# EAGLE design wavefreak (EAGLE 7.4.0)

## Sheet 1 of 3
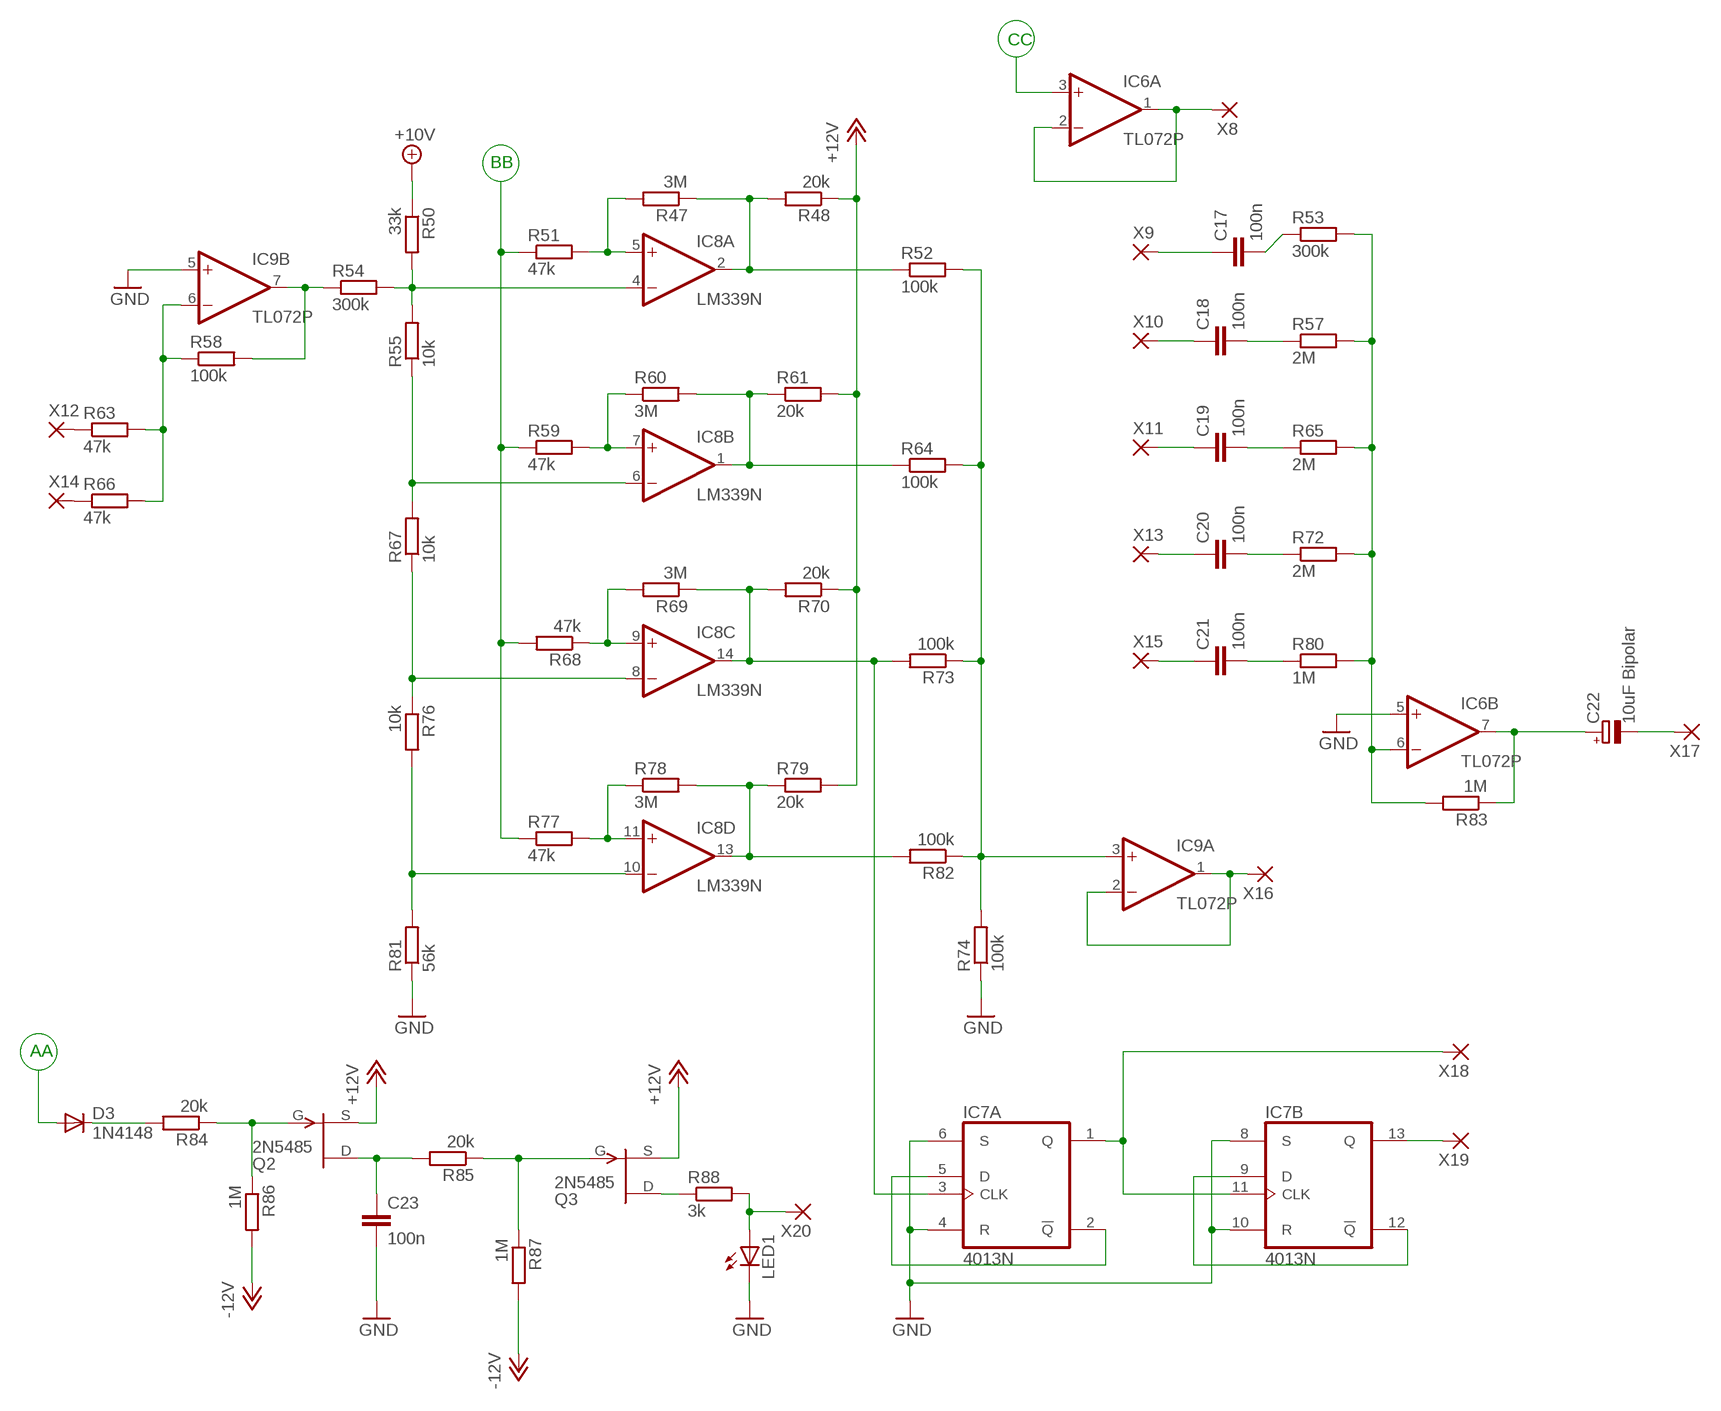
[diagram p0: schematic, sheet 1]

### Parts
C17  100n  C-EU050-025X075  [C050-025X075]
C18  100n  C-EU050-025X075  [C050-025X075]
C19  100n  C-EU050-025X075  [C050-025X075]
C20  100n  C-EU050-025X075  [C050-025X075]
C21  100n  C-EU050-025X075  [C050-025X075]
C22  10uF Bipolar  CPOL-EUE3.5-8  [E3,5-8]
C23  100n  C-EU050-025X075  [C050-025X075]
D3  1N4148  1N4148DO35-7  [DO35-7]
IC6  TL072P  [DIL08]
IC7  4013N  [DIL14]
IC8  LM339N  [DIL14]
IC9  TL072P  [DIL08]
LED1  LED3MM  [LED3MM]
Q2  2N5485  [TO92-]
Q3  2N5485  [TO92-]
R47  3M  R-EU_0309/10  [0309/10]
R48  20k  R-EU_0309/10  [0309/10]
R50  33k  R-EU_0309/10  [0309/10]
R51  47k  R-EU_0309/10  [0309/10]
R52  100k  R-EU_0309/10  [0309/10]
R53  300k  R-EU_0309/V  [0309V]
R54  300k  R-EU_0309/V  [0309V]
R55  10k  R-EU_0309/10  [0309/10]
R57  2M  R-EU_0309/V  [0309V]
R58  100k  R-EU_0309/V  [0309V]
R59  47k  R-EU_0309/10  [0309/10]
R60  3M  R-EU_0309/10  [0309/10]
R61  20k  R-EU_0309/10  [0309/10]
R63  47k  R-EU_0309/V  [0309V]
R64  100k  R-EU_0309/10  [0309/10]
R65  2M  R-EU_0309/V  [0309V]
R66  47k  R-EU_0309/V  [0309V]
R67  10k  R-EU_0309/10  [0309/10]
R68  47k  R-EU_0309/10  [0309/10]
R69  3M  R-EU_0309/10  [0309/10]
R70  20k  R-EU_0309/10  [0309/10]
R72  2M  R-EU_0309/V  [0309V]
R73  100k  R-EU_0309/10  [0309/10]
R74  100k  R-EU_0309/10  [0309/10]
R76  10k  R-EU_0309/10  [0309/10]
R77  47k  R-EU_0309/10  [0309/10]
R78  3M  R-EU_0309/10  [0309/10]
R79  20k  R-EU_0309/10  [0309/10]
R80  1M  R-EU_0309/V  [0309V]
R81  56k  R-EU_0309/10  [0309/10]
R82  100k  R-EU_0309/10  [0309/10]
R83  1M  R-EU_0309/V  [0309V]
R84  20k  R-EU_0309/V  [0309V]
R85  20k  R-EU_0309/V  [0309V]
R86  1M  R-EU_0309/V  [0309V]
R87  1M  R-EU_0309/V  [0309V]
R88  3k  R-EU_0309/V  [0309V]
X8  2,54/1,0  [2,54/1,0]
X9  2,54/1,0  [2,54/1,0]
X10  2,54/1,0  [2,54/1,0]
X11  2,54/1,0  [2,54/1,0]
X12  2,54/1,0  [2,54/1,0]
X13  2,54/1,0  [2,54/1,0]
X14  2,54/1,0  [2,54/1,0]
X15  2,54/1,0  [2,54/1,0]
X16  2,54/1,0  [2,54/1,0]
X17  2,54/1,0  [2,54/1,0]
X18  2,54/1,0  [2,54/1,0]
X19  2,54/1,0  [2,54/1,0]
X20  2,54/1,0  [2,54/1,0]

### Nets
+10V: R50.1 ; also sheet 2
+12V: Q2.2(S) Q3.2(S) R48.1 R61.2 R70.1 R79.2 ; also sheet 2,3
-12V: R86.2 R87.2 ; also sheet 2,3
AA: D3.A ; also sheet 2
BB: R51.1 R59.1 R68.2 R77.1 ; also sheet 2
CC: IC6.3(A:+IN) ; also sheet 2
GND: C23.2 IC6.5(B:+IN) IC7.4(A:R) IC7.6(A:S) IC7.8(B:S) IC7.10(B:R) IC9.5(B:+IN) LED1.K(C) R74.1 R81.1 ; also sheet 2,3
N$39: C18.1 X10.1(P)
N$43: C17.2 R53.1
N$44: C18.2 R57.1
N$45: C19.2 R65.1
N$46: C20.2 R72.1
N$47: C21.2 R80.1
N$48: C22.+ IC6.7(B:OUT) R83.1
N$49: LED1.A R88.2 X20.1(P)
N$50: Q3.3(D) R88.1
N$51: IC6.6(B:-IN) R53.2 R57.2 R65.2 R72.2 R80.2 R83.2
N$52: C19.1 X11.1(P)
N$53: C20.1 X13.1(P)
N$54: C21.1 X15.1(P)
N$55: IC9.1(A:OUT) IC9.2(A:-IN) X16.1(P)
N$56: IC9.6(B:-IN) R58.1 R63.2 R66.2
N$57: R63.1 X12.1(P)
N$58: R66.1 X14.1(P)
N$59: IC9.7(B:OUT) R54.1 R58.2
N$60: IC8.4(A:-IN) R50.2 R54.2 R55.2
N$61: IC8.6(B:-IN) R55.1 R67.2
N$62: IC8.8(C:-IN) R67.1 R76.1
N$63: IC8.10(D:-IN) R76.2 R81.2
N$64: IC8.11(D:+IN) R77.2 R78.1
N$65: IC8.9(C:+IN) R68.1 R69.2
N$66: IC8.7(B:+IN) R59.2 R60.1
N$67: IC8.5(A:+IN) R47.2 R51.2
N$68: IC8.2(A:OUT) R47.1 R48.2 R52.1
N$69: IC8.1(B:OUT) R60.2 R61.1 R64.1
N$70: IC7.3(A:CLK) IC8.14(C:OUT) R69.1 R70.2 R73.2
N$71: IC8.13(D:OUT) R78.2 R79.1 R82.2
N$72: IC9.3(A:+IN) R52.2 R64.2 R73.1 R74.2 R82.1
N$73: C17.1 X9.1(P)
N$74: Q3.1(G) R85.1 R87.1
N$75: C23.1 Q2.3(D) R85.2
N$76: IC7.2(A:!Q) IC7.5(A:D)
N$77: IC7.1(A:Q) IC7.11(B:CLK) X18.1(P)
N$78: IC7.9(B:D) IC7.12(B:!Q)
N$79: IC7.13(B:Q) X19.1(P)
N$80: C22.- X17.1(P)
N$81: Q2.1(G) R84.1 R86.1
N$82: D3.C R84.2
N$83: IC6.1(A:OUT) IC6.2(A:-IN) X8.1(P)

### Notes on the sheet
- CC
- BB
- AA

## Sheet 2 of 3
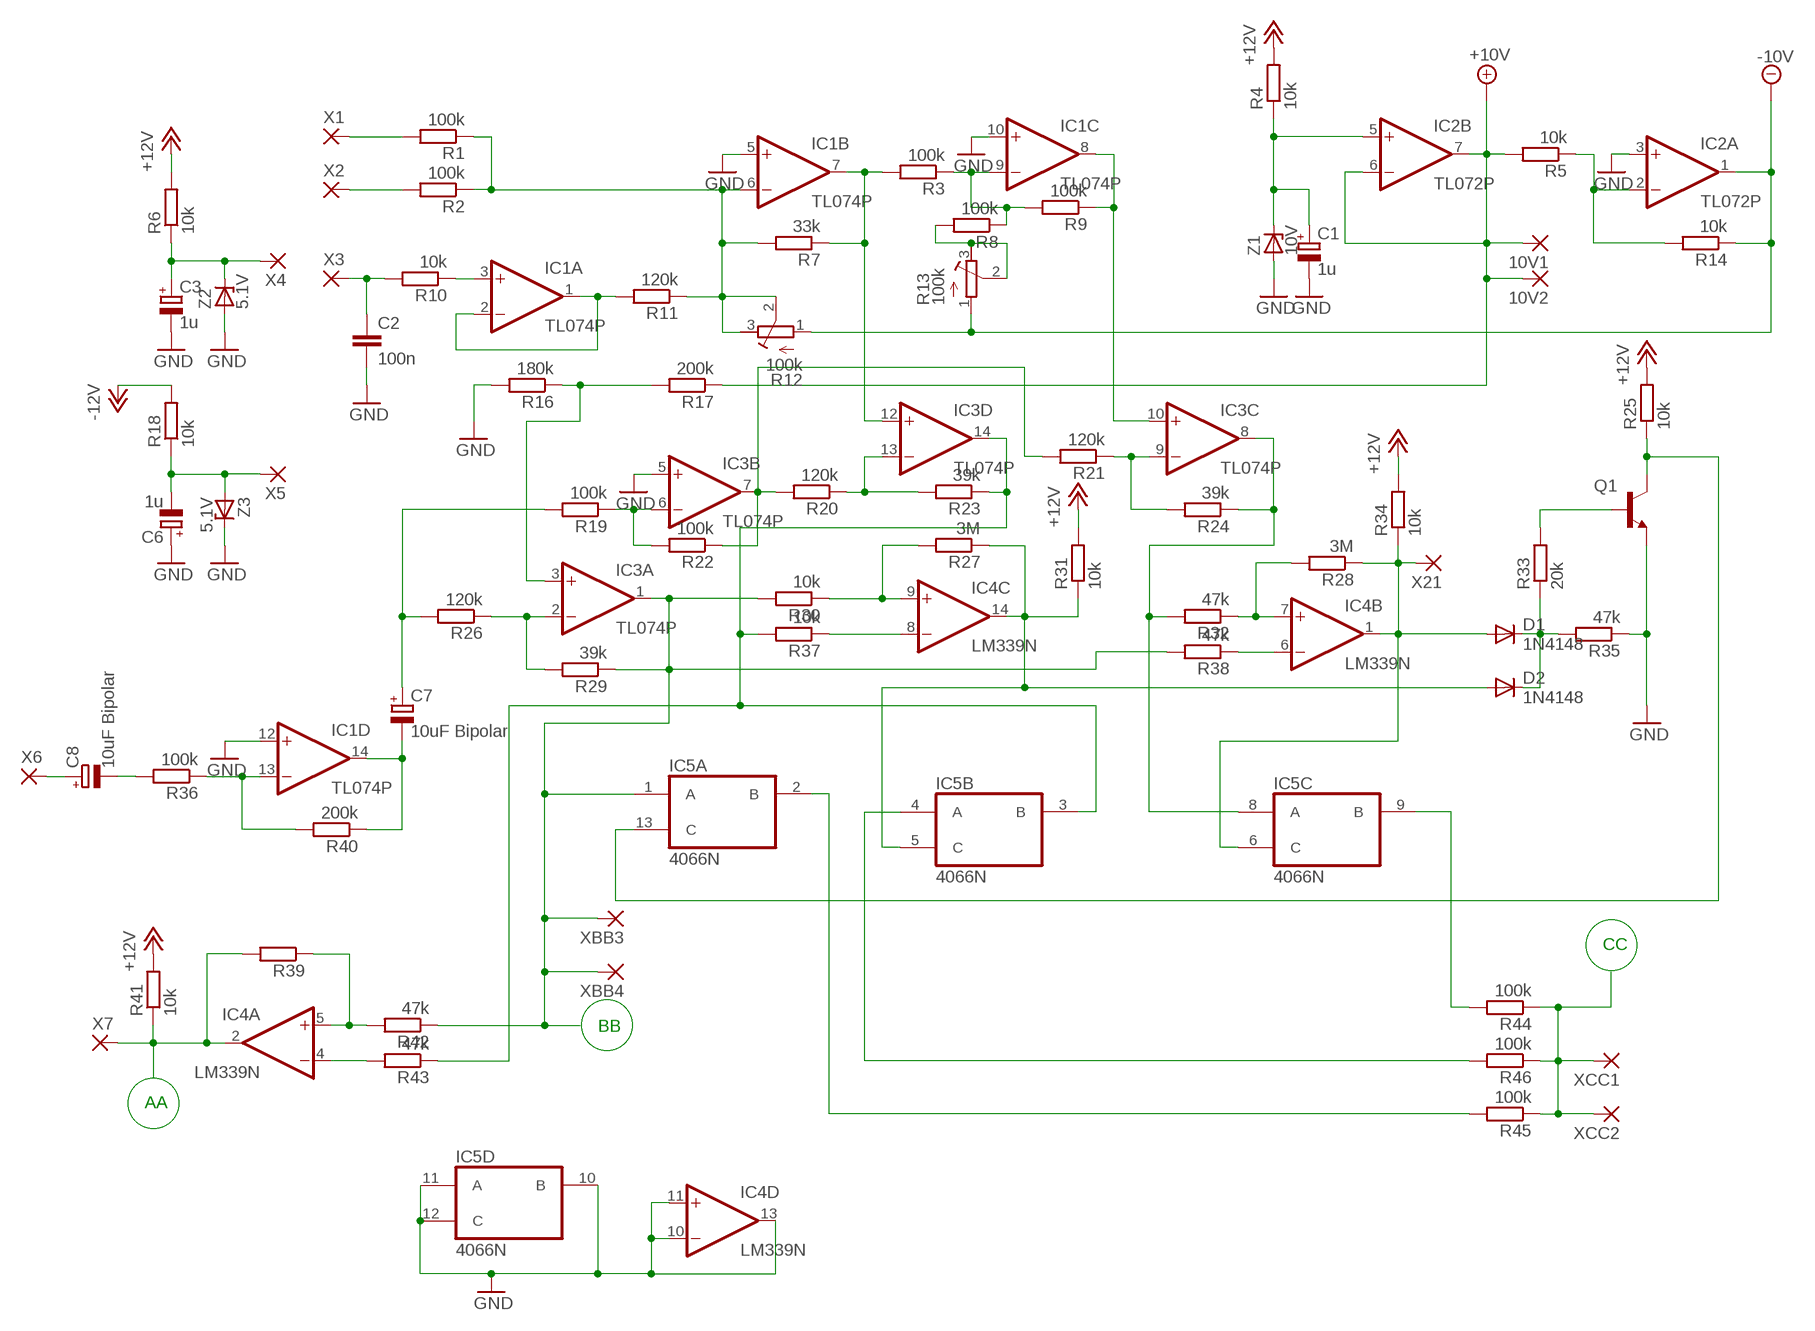
[diagram p1: schematic, sheet 2]

### Parts
10V1  2,54/1,0  [2,54/1,0]
10V2  2,54/1,0  [2,54/1,0]
C1  1u  CPOL-EUE2.5-5  [E2,5-5]
C2  100n  C-EU050-025X075  [C050-025X075]
C3  1u  CPOL-EUE2.5-5  [E2,5-5]
C6  1u  CPOL-EUE2.5-5  [E2,5-5]
C7  10uF Bipolar  CPOL-EUE3.5-8  [E3,5-8]
C8  10uF Bipolar  CPOL-EUE3.5-8  [E3,5-8]
D1  1N4148  1N4148DO35-7  [DO35-7]
D2  1N4148  1N4148DO35-7  [DO35-7]
IC1  TL074P  [DIL14]
IC2  TL072P  [DIL08]
IC3  TL074P  [DIL14]
IC4  LM339N  [DIL14]
IC5  4066N  [DIL14]
Q1  2N3904-NPN-TO92-EBC  [TO92-EBC]
R1  100k  R-EU_0309/V  [0309V]
R2  100k  R-EU_0309/V  [0309V]
R3  100k  R-EU_0309/V  [0309V]
R4  10k  R-EU_0309/V  [0309V]
R5  10k  R-EU_0309/V  [0309V]
R6  10k  R-EU_0309/V  [0309V]
R7  33k  R-EU_0309/V  [0309V]
R8  100k  R-EU_0309/V  [0309V]
R9  100k  R-EU_0309/V  [0309V]
R10  10k  R-EU_0309/V  [0309V]
R11  120k  R-EU_0309/V  [0309V]
R12  100k  R-TRIMM64W  [RTRIM64W]
R13  100k  R-TRIMM64W  [RTRIM64W]
R14  10k  R-EU_0309/V  [0309V]
R16  180k  R-EU_0309/V  [0309V]
R17  200k  R-EU_0309/V  [0309V]
R18  10k  R-EU_0309/V  [0309V]
R19  100k  R-EU_0309/V  [0309V]
R20  120k  R-EU_0309/V  [0309V]
R21  120k  R-EU_0309/V  [0309V]
R22  100k  R-EU_0309/V  [0309V]
R23  39k  R-EU_0309/V  [0309V]
R24  39k  R-EU_0309/V  [0309V]
R25  10k  R-EU_0309/V  [0309V]
R26  120k  R-EU_0309/V  [0309V]
R27  3M  R-EU_0309/V  [0309V]
R28  3M  R-EU_0309/V  [0309V]
R29  39k  R-EU_0309/V  [0309V]
R30  10k  R-EU_0309/V  [0309V]
R31  10k  R-EU_0309/V  [0309V]
R32  47k  R-EU_0309/V  [0309V]
R33  20k  R-EU_0309/V  [0309V]
R34  10k  R-EU_0309/V  [0309V]
R35  47k  R-EU_0309/V  [0309V]
R36  100k  R-EU_0309/V  [0309V]
R37  10k  R-EU_0309/V  [0309V]
R38  47k  R-EU_0309/V  [0309V]
R39  R-EU_0309/V  [0309V]
R40  200k  R-EU_0309/V  [0309V]
R41  10k  R-EU_0309/V  [0309V]
R42  47k  R-EU_0309/V  [0309V]
R43  47k  R-EU_0309/V  [0309V]
R44  100k  R-EU_0309/V  [0309V]
R45  100k  R-EU_0309/V  [0309V]
R46  100k  R-EU_0309/V  [0309V]
X1  2,54/1,0  [2,54/1,0]
X2  2,54/1,0  [2,54/1,0]
X3  2,54/1,0  [2,54/1,0]
X4  2,54/1,0  [2,54/1,0]
X5  2,54/1,0  [2,54/1,0]
X6  2,54/1,0  [2,54/1,0]
X7  2,54/1,0  [2,54/1,0]
X21  2,54/1,0  [2,54/1,0]
XBB3  2,54/1,0  [2,54/1,0]
XBB4  2,54/1,0  [2,54/1,0]
XCC1  2,54/1,0  [2,54/1,0]
XCC2  2,54/1,0  [2,54/1,0]
Z1  10V  BZV10  [DO34Z7]
Z2  5.1V  BZV10  [DO34Z7]
Z3  5.1V  BZV10  [DO34Z7]

### Nets
+10V: 10V1.1(P) 10V2.1(P) IC2.6(B:-IN) IC2.7(B:OUT) R5.2 R17.1 ; also sheet 1
+12V: R4.2 R6.2 R25.2 R31.2 R34.2 R41.2 ; also sheet 1,3
-10V: IC2.1(A:OUT) R12.1(A) R13.1(A) R14.1
-12V: R18.2 ; also sheet 1,3
AA: IC4.2(A:OUT) R39.2 R41.1 X7.1(P) ; also sheet 1
BB: IC3.1(A:OUT) IC5.1(A:A) R29.1 R30.2 R38.2 R42.1 XBB3.1(P) XBB4.1(P) ; also sheet 1
CC: R44.1 R45.1 R46.1 XCC1.1(P) XCC2.1(P) ; also sheet 1
GND: C1.- C2.2 C3.- C6.+ IC1.5(B:+IN) IC1.10(C:+IN) IC1.12(D:+IN) IC2.3(A:+IN) IC3.5(B:+IN) IC4.10(D:-IN) IC4.11(D:+IN) IC4.13(D:OUT) IC5.10(D:B) IC5.11(D:A) IC5.12(D:C) Q1.E R16.2 R35.1 Z1.A Z2.A Z3.C ; also sheet 1,3
N$1: R1.2 X1.1(P)
N$2: R2.2 X2.1(P)
N$3: IC1.6(B:-IN) R1.1 R2.1 R7.2 R11.1 R12.2(S) R12.3(E)
N$4: IC1.7(B:OUT) IC3.12(D:+IN) R3.2 R7.1
N$5: IC1.9(C:-IN) R3.1 R8.1 R9.2
N$6: C2.1 R10.2 X3.1(P)
N$7: IC1.3(A:+IN) R10.1
N$8: IC1.1(A:OUT) IC1.2(A:-IN) R11.2
N$9: C3.+ R6.1 X4.1(P) Z2.C
N$10: C6.- R18.1 X5.1(P) Z3.A
N$11: C8.+ X6.1(P)
N$12: IC1.8(C:OUT) IC3.10(C:+IN) R9.1
N$13: R8.2 R13.2(S) R13.3(E)
N$14: C8.- R36.2
N$15: IC3.3(A:+IN) R16.1 R17.2
N$16: C7.- IC1.14(D:OUT) R40.1
N$17: IC3.6(B:-IN) R19.1 R22.2
N$18: IC3.2(A:-IN) R26.1 R29.2
N$19: C7.+ R19.2 R26.2
N$20: C1.+ IC2.5(B:+IN) R4.1 Z1.C
N$21: IC1.13(D:-IN) R36.1 R40.2
N$22: IC4.5(A:+IN) R39.1 R42.2
N$23: IC2.2(A:-IN) R5.1 R14.2
N$24: IC4.4(A:-IN) R43.2
N$25: IC4.9(C:+IN) R27.2 R30.1
N$26: IC4.8(C:-IN) R37.1
N$27: IC3.14(D:OUT) IC5.3(B:B) R23.1 R37.2 R43.1
N$28: IC3.13(D:-IN) R20.1 R23.2
N$29: IC3.7(B:OUT) R20.2 R21.2 R22.1
N$30: IC3.9(C:-IN) R21.1 R24.2
N$31: D1.C D2.C R33.1 R35.2
N$32: IC3.8(C:OUT) IC5.8(C:A) R24.1 R32.2
N$33: D2.A IC4.14(C:OUT) IC5.5(B:C) R27.1 R31.1
N$34: Q1.B R33.2
N$35: IC4.6(B:-IN) R38.1
N$36: IC4.7(B:+IN) R28.2 R32.1
N$37: IC5.13(A:C) Q1.C R25.1
N$38: D1.A IC4.1(B:OUT) IC5.6(C:C) R28.1 R34.1 X21.1(P)
N$40: IC5.9(C:B) R44.2
N$41: IC5.4(B:A) R46.2
N$42: IC5.2(A:B) R45.2

### Notes on the sheet
- CC
- BB
- AA

## Sheet 3 of 3
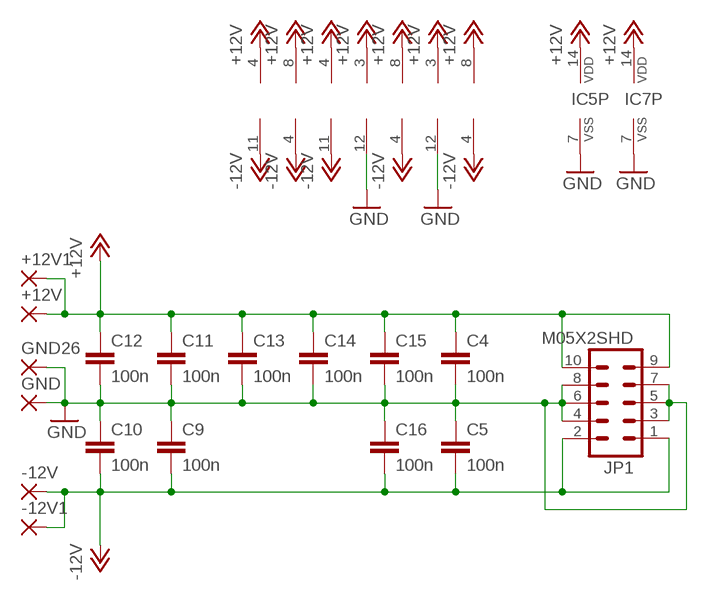
[diagram p2: schematic, sheet 3]

### Parts
+12V  2,54/1,0  [2,54/1,0]
+12V1  2,54/1,0  [2,54/1,0]
-12V  2,54/1,0  [2,54/1,0]
-12V1  2,54/1,0  [2,54/1,0]
C4  100n  C-EU025-025X050  [C025-025X050]
C5  100n  C-EU025-025X050  [C025-025X050]
C9  100n  C-EU025-025X050  [C025-025X050]
C10  100n  C-EU025-025X050  [C025-025X050]
C11  100n  C-EU025-025X050  [C025-025X050]
C12  100n  C-EU025-025X050  [C025-025X050]
C13  100n  C-EU025-025X050  [C025-025X050]
C14  100n  C-EU025-025X050  [C025-025X050]
C15  100n  C-EU025-025X050  [C025-025X050]
C16  100n  C-EU025-025X050  [C025-025X050]
GND  2,54/1,0  [2,54/1,0]
GND26  2,54/1,0  [2,54/1,0]
JP1  M05X2SHD  [2X5-SHROUDED]

### Nets
+12V: +12V1.1(P) +12V.1(P) C4.1 C11.1 C12.1 C13.1 C14.1 C15.1 IC1.4(P:V+) IC2.8(P:V+) IC3.4(P:V+) IC4.3(P:V+) IC5.14(P:VDD) IC6.8(P:V+) IC7.14(P:VDD) IC8.3(P:V+) IC9.8(P:V+) JP1.9 JP1.10 ; also sheet 1,2
-12V: -12V1.1(P) -12V.1(P) C5.2 C9.2 C10.2 C16.2 IC1.11(P:V-) IC2.4(P:V-) IC3.11(P:V-) IC6.4(P:V-) IC9.4(P:V-) JP1.1 JP1.2 ; also sheet 1,2
GND: C4.2 C5.1 C9.1 C10.1 C11.2 C12.2 C13.2 C14.2 C15.2 C16.1 GND26.1(P) GND.1(P) IC4.12(P:GND) IC5.7(P:VSS) IC7.7(P:VSS) IC8.12(P:GND) JP1.3 JP1.4 JP1.5 JP1.6 JP1.7 JP1.8 ; also sheet 1,2

## Library data of the parts
10V1 10V2 +12V +12V1 -12V -12V1 GND GND26 X1-X21 XBB3 XBB4 XCC1 XCC2 = wirepad:2,54/1,0: THROUGH-HOLE PAD
C1 C3 C6-C8 C22 = rcl:CPOL-EU: POLARIZED CAPACITOR, European symbol
C2 C4 C5 C9-C21 C23 = rcl:C-EU: CAPACITOR, European symbol
D1-D3 = diode:1N4148: DIODE high speed (Philips)
IC1 IC3 = cavalier:TL074: OP AMP
IC2 IC6 IC9 = cavalier:TL072: OP AMP
IC4 IC8 = cavalier:LM339: Low Power Low Offset Voltage Quad Comparators with open collector; LM139/LM239/LM339/LM2901/LM3302
IC5 = 40xx:4066: Quad bilateral ANALOG SWITCH
IC7 = 40xx:4013: Dual D FLIP FLOP, set/reset
JP1 = SparkFun:M05X2: Header 5x2 Standard 10-pin dual row 0.1" header. Commonly used with AVR-ISP. Use with Spark Fun Electronics SKU: PRT-00778
LED1 = led:LED: LED OSRAM: - CHIPLED LG R971, LG N971, LY N971, LG Q971, LY Q971, LO R971, LY R971 LH N974, LH R974 LS Q976, LO Q976, LY Q976 LO Q996 - Hyper CHIPLED LW Q18S LB Q993, LB Q99A, LB R99A - SideLED LS A670, LO A670, LY A670, LG A670, LP A670 LB A673, LV A673, LT A673, LW A673 LH A674 LY A675 LS A676, LA A676, LO A676, LY A676, LW A676 LS A679, LY A679, LG A679 - Hyper Micro SIDELED® LS Y876, LA Y876, LO Y876, LY Y876 LT Y87S - SmartLED LW L88C, LW L88S LB L89C, LB L89S, LG L890 LS L89K, LO L89K, LY L89K LS L896, LA L896, LO L896, LY L896 - TOPLED LS T670, LO T670, LY T670, LG T670, LP T670 LSG T670, LSP T670, LSY T670, LOP T670, LYG T670 LG T671, LOG T671, LSG T671 LB T673, LV T673, LT T673, LW T673 LH T674 LS T676, LA T676, LO T676, LY T676, LB T676, LH T676, LSB T676, LW T676 LB T67C, LV T67C, LT T67C, LS T67K, LO T67K, LY T67K, LW E67C LS E67B, LA E67B, LO E67B, LY E67B, LB E67C, LV E67C, LT E67C LW T67C LS T679, LY T679, LG T679 LS T770, LO T770, LY T770, LG T770, LP T770 LB T773, LV T773, LT T773, LW T773 LH T774 LS E675, LA E675, LY E675, LS T675 LS T776, LA T776, LO T776, LY T776, LB T776 LHGB T686 LT T68C, LB T68C - Hyper Mini TOPLED® LB M676 - Mini TOPLED Santana® LG M470 LS M47K, LO M47K, LY M47K Source: http://www.osram.convergy.de LUXEON: - LUMILED® LXK2-PW12-R00, LXK2-PW12-S00, LXK2-PW14-U00, LXK2-PW14-V00 LXK2-PM12-R00, LXK2-PM12-S00, LXK2-PM14-U00 LXK2-PE12-Q00, LXK2-PE12-R00, LXK2-PE12-S00, LXK2-PE14-T00, LXK2-PE14-U00 LXK2-PB12-K00, LXK2-PB12-L00, LXK2-PB12-M00, LXK2-PB14-N00, LXK2-PB14-P00, LXK2-PB14-Q00 LXK2-PR12-L00, LXK2-PR12-M00, LXK2-PR14-Q00, LXK2-PR14-R00 LXK2-PD12-Q00, LXK2-PD12-R00, LXK2-PD12-S00 LXK2-PH12-R00, LXK2-PH12-S00 LXK2-PL12-P00, LXK2-PL12-Q00, LXK2-PL12-R00 Source: www.luxeon.com KINGBRIGHT: KA-3528ASYC Source: www.kingbright.com
Q1 = transistor-neu-to92:*-NPN-: NPN Transistror
Q2 Q3 = transistor-fet:?548*: N-Channel JFETs Source: VISHAY 2N5484.pdf Compatible: TO92 2N5245 J304 J305 U310 J308 J309 J310 TO72 2N4416 2N4416A 2N3823 2N4351 3N169 3N170 3N171 MFE3002 TO18 2N3796 2N3797 MFE825 Source: Motorola European Master Guide Pacge 3-59
R1-R11 R14 R16-R48 R50-R55 R57-R61 R63-R70 R72-R74 R76-R88 = rcl:R-EU_: RESISTOR, European symbol
R12 R13 = rcl:R-TRIMM: Trimm resistor
Z1-Z3 = diode:BZV10: Z DIODE

## Board
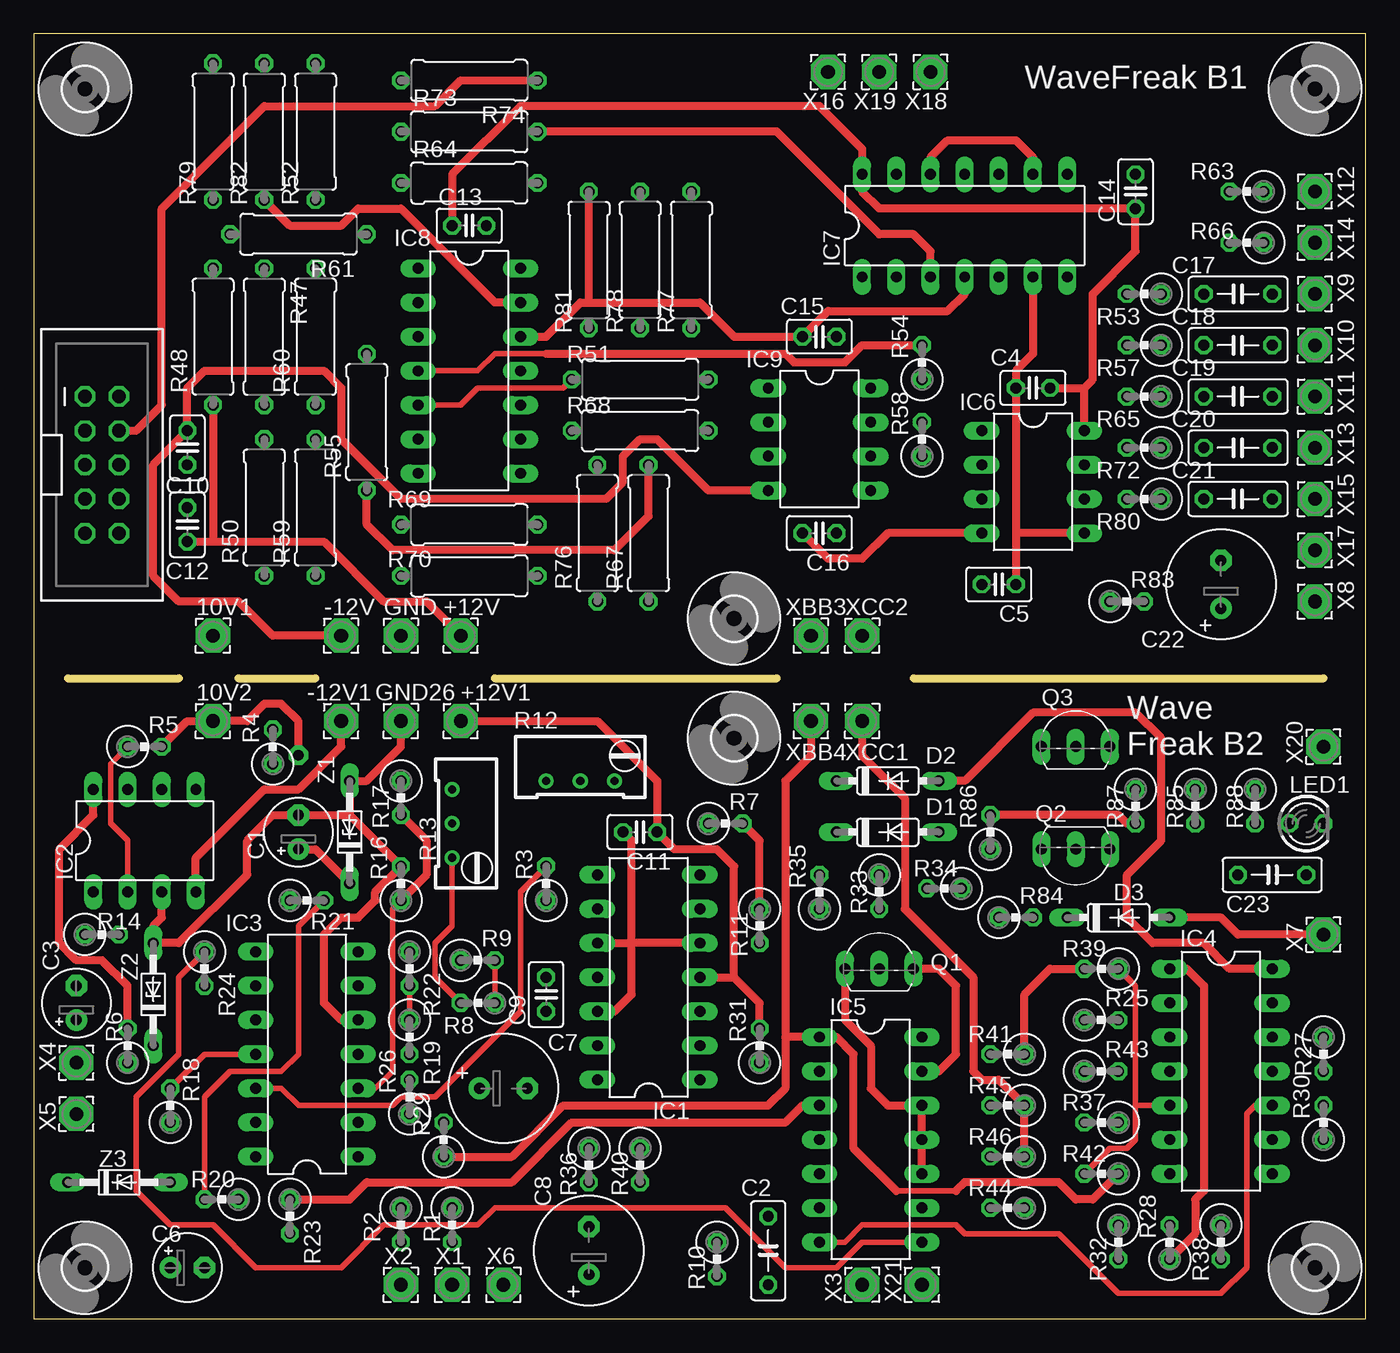
[diagram p3: board, top side]
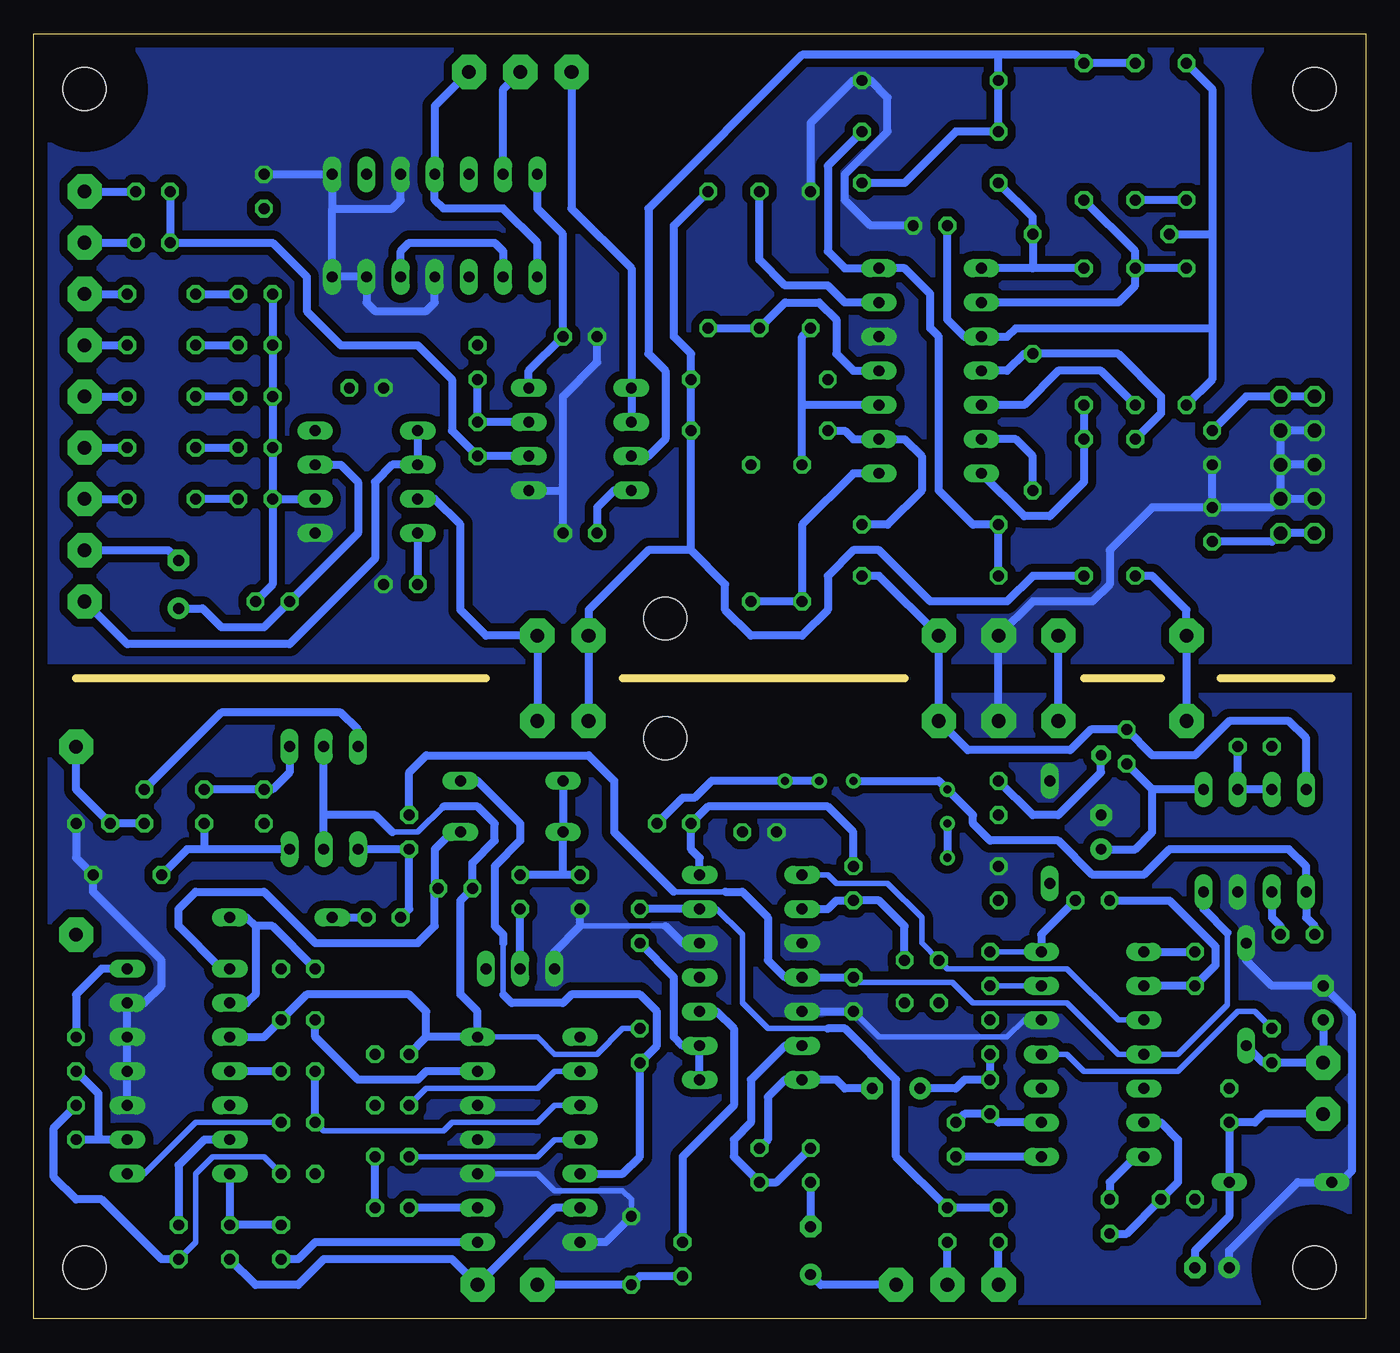
[diagram p4: board, bottom side, seen from below]

Size 99.04 x 95.56 mm. Coordinates in mm from the lower left corner, seen from the top.
Outline: 0,0 99.04,0 99.04,95.56 0,95.56 0,0
Copper layers (1*16): Top 0.035mm / dielectric 1.5mm / Bottom 0.035mm
Design rules "default": minimum track width 10mil, minimum drill 24mil, track to track 8mil, track to pad 8mil, pad to pad 8mil, via to via 8mil, smd to smd 8mil, copper to edge 40mil, drill to drill 8mil, minimum pad ring 10mil, minimum via ring 8mil, stop-mask expansion 4mil, vias tented up to drill 0mil, thermal gap 10mil
Milling: 4 lines

### Footprints (pad centres in the part's own frame; a part is rotated, then mirrored left to right if it is on the bottom)
2,54/1,0 = drill 1.016 pad 2.54 octagon: 1 0,0
E2,5-5 = drill 0.813 pad 1.6: + -1.27,0 | drill 0.813 pad 1.6 octagon: - 1.27,0
C050-025X075 = drill 0.813 octagon: 1 -2.54,0; 2 2.54,0
C025-025X050 = drill 0.813 octagon: 1 -1.27,0; 2 1.27,0
E3,5-8 = drill 0.813 pad 1.6: + -1.778,0 | drill 0.813 pad 1.6 octagon: - 1.778,0
DO35-7 = drill 0.813 long: A 3.81,0; C -3.81,0
DIL14 = drill 0.813 long: 1 -7.62,-3.81; 2 -5.08,-3.81; 3 -2.54,-3.81; 4 0,-3.81; 5 2.54,-3.81; 6 5.08,-3.81; 7 7.62,-3.81; 8 7.62,3.81; 9 5.08,3.81; 10 2.54,3.81; 11 0,3.81; 12 -2.54,3.81; 13 -5.08,3.81; 14 -7.62,3.81
DIL08 = drill 0.813 pad 1.27 long: 1 -3.81,-3.81; 2 -1.27,-3.81; 3 1.27,-3.81; 4 3.81,-3.81; 5 3.81,3.81; 6 1.27,3.81; 7 -1.27,3.81; 8 -3.81,3.81
2X5-SHROUDED = drill 1.016 octagon: 1 -1.27,5.08; 2 1.27,5.08; 3 -1.27,2.54; 4 1.27,2.54; 5 -1.27,0; 6 1.27,0; 7 -1.27,-2.54; 8 1.27,-2.54; 9 -1.27,-5.08; 10 1.27,-5.08
LED3MM = drill 0.813 octagon: A -1.27,0; K 1.27,0
TO92-EBC = drill 0.813 long: B 0,-1.27; C 2.54,-1.27; E -2.54,-1.27
TO92- = drill 0.813 long: 1 2.54,0; 2 0,0; 3 -2.54,0
0309V = drill 0.813 octagon: 1 -1.27,0; 2 1.27,0
RTRIM64W = drill 0.61: 1 1.27,-2.54; 2 1.27,0; 3 1.27,2.54
0309/10 = drill 0.813 octagon: 1 -5.08,0; 2 5.08,0
3,2 = hole 3.2: 0,0
DO34Z7 = drill 0.813 long: A 3.81,0; C -3.81,0

### Placement (x,y rotation side)
10V1  13.34,50.8 0 top
10V2  13.34,44.45 0 top
+12V  31.75,50.8 0 top
+12V1  31.75,44.45 0 top
-12V  22.86,50.8 0 top
-12V1  22.86,44.45 0 top
C1  19.68,36.2 90 top
C2  54.61,5.08 90 top
C3  3.17,23.5 90 top
C4  74.3,69.22 180 top
C5  71.75,54.61 180 top
C6  11.43,3.81 0 top
C7  34.92,17.14 0 top
C8  41.27,5.08 90 top
C9  38.1,24.13 90 top
C10  11.43,64.77 90 top
C11  45.09,36.2 180 top
C12  11.43,59.05 90 top
C13  32.38,81.28 0 top
C14  81.92,83.82 90 top
C15  58.42,73.03 180 top
C16  58.42,58.42 180 top
C17  89.53,76.2 180 top
C18  89.53,72.39 180 top
C19  89.53,68.58 180 top
C20  89.53,64.77 180 top
C21  89.53,60.96 180 top
C22  88.27,54.61 90 top
C23  92.08,33.02 0 top
D1  63.5,36.2 0 top
D2  63.5,40.01 0 top
D3  80.64,29.84 0 top
GND  27.3,50.8 0 top
GND26  27.3,44.45 0 top
IC1  45.72,25.4 90 top
IC2  8.26,35.56 0 top
IC3  20.32,19.68 90 top
IC4  88.27,18.41 270 top
IC5  62.23,13.34 270 top
IC6  74.3,62.23 270 top
IC7  69.22,81.28 0 top
IC8  32.38,70.48 270 top
IC9  58.42,65.41 270 top
JP1  5.08,63.5 0 top
LED1  94.61,36.83 0 top
Q1  62.87,27.3 0 top
Q2  77.47,34.92 180 top
Q3  77.47,42.55 0 top
R1  31.11,6.99 270 top
R2  27.3,6.99 270 top
R3  38.1,32.38 90 top
R4  17.78,42.55 90 top
R5  8.26,42.55 0 top
R6  6.99,20.32 90 top
R7  51.44,36.83 0 top
R8  33.02,23.5 180 top
R9  33.02,26.67 0 top
R10  50.8,4.45 270 top
R11  53.98,29.21 270 top
R12  40.64,41.27 270 top
R13  32.38,36.83 180 top
R14  5.08,28.57 0 top
R16  27.3,32.38 90 top
R17  27.3,38.73 270 top
R18  10.16,15.88 90 top
R19  27.94,20.95 270 top
R20  13.97,8.89 180 top
R21  20.32,31.11 0 top
R22  27.94,26.04 270 top
R23  19.05,7.62 270 top
R24  12.7,26.04 270 top
R25  79.38,22.23 0 top
R26  27.94,16.51 90 top
R27  95.89,19.68 270 top
R28  84.45,5.71 90 top
R29  30.48,13.34 90 top
R30  95.89,14.61 90 top
R31  53.98,20.32 90 top
R32  80.64,5.71 270 top
R33  62.87,31.75 270 top
R34  67.69,32 180 top
R35  58.42,31.75 90 top
R36  41.27,11.43 270 top
R37  79.38,14.61 180 top
R38  88.27,5.71 270 top
R39  79.38,26.04 180 top
R40  45.09,11.43 270 top
R41  72.39,19.68 180 top
R42  79.38,10.79 180 top
R43  79.38,18.41 0 top
R44  72.39,8.26 180 top
R45  72.39,15.88 180 top
R46  72.39,12.06 180 top
R47  17.14,73.03 270 top
R48  13.34,73.03 90 top
R50  17.14,60.33 90 top
R51  45.09,69.85 180 top
R52  20.95,88.27 90 top
R53  82.55,76.2 180 top
R54  66.04,71.12 90 top
R55  24.77,66.67 90 top
R57  82.55,72.39 180 top
R58  66.04,65.41 90 top
R59  20.95,60.33 90 top
R60  20.95,73.03 90 top
R61  19.68,80.64 180 top
R63  90.17,83.82 180 top
R64  32.38,84.45 0 top
R65  82.55,68.58 180 top
R66  90.17,80.01 180 top
R67  45.72,58.42 90 top
R68  45.09,66.04 0 top
R69  32.38,59.05 0 top
R70  32.38,55.24 180 top
R72  82.55,64.77 180 top
R73  32.38,88.27 0 top
R74  32.38,92.08 180 top
R76  41.91,58.42 90 top
R77  48.9,78.74 270 top
R78  45.09,78.74 90 top
R79  13.34,88.27 90 top
R80  82.55,60.96 180 top
R81  41.27,78.74 270 top
R82  17.14,88.27 270 top
R83  81.28,53.34 0 top
R84  73.03,29.84 0 top
R85  86.36,38.1 270 top
R86  71.12,36.2 90 top
R87  81.92,38.1 270 top
R88  90.81,38.1 270 top
U$1  [3,2]  3.81,3.81 0 top
U$2  [3,2]  3.81,91.44 0 top
U$3  [3,2]  95.25,91.44 0 top
U$4  [3,2]  95.25,3.81 0 top
U$5  [3,2]  52.07,43.18 0 top
U$6  [3,2]  52.07,52.07 0 top
X1  31.11,2.54 0 top
X2  27.3,2.54 0 top
X3  61.59,2.54 90 top
X4  3.17,19.05 90 top
X5  3.17,15.24 90 top
X6  34.92,2.54 0 top
X7  95.89,28.57 90 top
X8  95.25,53.34 90 top
X9  95.25,76.2 0 top
X10  95.25,72.39 0 top
X11  95.25,68.58 0 top
X12  95.25,83.82 90 top
X13  95.25,64.77 0 top
X14  95.25,80.01 90 top
X15  95.25,60.96 0 top
X16  59.05,92.71 90 top
X17  95.25,57.15 90 top
X18  66.67,92.71 90 top
X19  62.87,92.71 90 top
X20  95.89,42.55 90 top
X21  66.04,2.54 90 top
XBB3  57.78,50.8 0 top
XBB4  57.78,44.45 0 top
XCC1  61.59,44.45 0 top
XCC2  61.59,50.8 0 top
Z1  23.5,36.2 90 top
Z2  8.89,24.13 90 top
Z3  6.35,10.16 0 top

### Tracks (layer width: path | path; a pad name or v marks a point on that pad's centre or on a via)
+10V  (via drill 0.8 pad 1.42)
  Top 0.61: R5.2 11.43,44.45 10V2.1 15.88,44.45 17.14,45.72 18.41,45.72 19.68,44.45 v19.68,41.91
  Bottom 0.61: 10V2.1 10V1.1 13.34,52.7 15.88,55.24 R50.1 | IC2.7 IC2.6 R5.2 | R17.1 24.77,37.47 22.86,37.47 19.68,40.64 v19.68,41.91
+12V
  Top 0.61: C13.1 31.11,85.09 36.2,90.17 58.42,90.17 61.59,87 IC7.14 61.59,83.82 62.87,82.55 C14.1 81.92,79.38 78.74,76.2 78.74,69.85 78.11,69.22 | IC6.8 78.11,69.22 | C4.1 78.11,69.22 | C12.1 13.34,57.78 | 13.34,57.78 21.59,57.78 26.04,53.34 29.21,53.34 +12V.1 | R48.1 13.34,57.78 | IC1.4 52.07,25.4 | 52.07,25.4 52.07,33.66 50.8,34.92 47.62,34.92 C11.1 46.35,40.01 41.91,44.45 +12V1.1 | R6.2 6.99,24.77 5.08,26.67 3.17,26.67 1.91,27.94 1.91,34.92 4.45,37.47 IC2.8 | R31.2 53.98,23.5 52.07,25.4
  Bottom 0.406: R6.2 8.26,22.86 9.53,22.86 13.97,18.41 20.95,18.41 22.23,19.68 IC3.4 | IC5.14 61.59,20.95 60.33,19.68 57.15,19.68 55.24,21.59 R31.2 | 68.58,38.1 70.48,36.2 72.39,36.2
  Bottom 0.61: JP1.9 JP1.10 6.99,57.78 C12.1 | R70.1 36.2,55.24 +12V.1 +12V1.1 29.59,42.29 21.97,42.29 20.45,43.81 R4.2 15.88,41.91 12.7,41.91 10.16,44.45 5.71,44.45 4.45,43.18 IC2.8 | R79.2 11.43,91.44 11.43,80.64 | 11.43,80.64 11.43,73.66 | 11.43,73.66 11.43,69.85 R48.1 | R61.2 11.43,80.64 | 11.43,73.66 26.04,73.66 26.67,73.03 IC8.3 29.84,73.03 31.11,74.3 C13.1 | IC9.8 62.23,70.48 C15.1 59.69,80.64 61.59,82.55 IC7.14 | 69.85,20.95 IC5.14 66.04,22.86 67.31,24.13 67.31,31.11 R34.2 66.42,33.91 64.77,35.56 64.77,36.83 66.04,38.1 68.58,38.1 | IC4.3 81.92,20.95 R25.2 78.74,24.13 71.12,24.13 69.85,22.86 69.85,20.95 | R41.2 69.85,20.95 | Q2.2 77.47,37.47 | 77.47,37.47 Q3.2 | 72.39,36.2 73.66,37.47 77.47,37.47
-10V
  Bottom 0.61: R12.1 31.75,40.01 R13.1 29.21,37.47 29.21,36.83 27.94,35.56 22.86,35.56 20.32,33.02 16.51,33.02 14.61,34.92 5.71,34.92 4.45,33.66 IC2.1 4.45,29.84 3.81,29.21 R14.1
-12V
  Top 0.406: R18.2 12.7,19.68 IC3.11
  Top 0.61: IC6.4 63.5,58.42 61.59,56.52 59.05,56.52 C16.2 | -12V.1 17.78,50.8 15.24,53.34 10.79,53.34 8.89,55.24 8.89,63.5 C10.2 11.43,69.22 12.7,70.48 21.59,70.48 22.86,69.22 22.86,65.41 27.3,60.96 42.55,60.96 43.81,62.23 43.81,64.14 45.09,65.41 46.35,65.41 50.16,61.59 IC9.4 | IC2.4 12.06,34.29 17.14,39.37 19.68,39.37 22.86,42.55 -12V1.1 | R87.2 81.28,36.83 80.64,37.47 R86.2
  Bottom 0.406: 10.29,28.7 10.29,23.37 13.97,19.68 IC3.11 18.41,19.68 22.23,23.5 29.21,23.5 30.73,25.02 37.72,25.02 C9.2 | 51.44,31.75 47.62,31.75
  Bottom 0.61: JP1.1 JP1.2 8.89,68.58 C10.2 | -12V1.1 -12V.1 | IC9.4 55.88,61.59 57.15,60.33 C16.2 | IC6.4 C5.2 | IC2.4 12.06,30.48 10.29,28.7 | C9.2 IC1.11 43.18,25.4 44.45,26.67 44.45,29.84 46.35,31.75 47.62,31.75 | R86.2 71.12,40.64 69.85,41.91 57.78,41.91 55.88,40.01 55.88,36.2 51.44,31.75
AA
  Top 0.61: R41.1 73.66,24.13 75.56,26.04 R39.2 | X7.1 89.53,28.57 88.27,29.84 D3.A
  Bottom 0.61: D3.A 83.19,29.84 82.55,29.21 | 82.55,29.21 82.55,24.13 83.19,23.5 IC4.2 | R39.2 81.28,29.21 82.55,29.21
BB
  Top 0.406: 68.58,9.53 64.14,9.53
  Top 0.61: R42.1 78.74,8.89 77.47,8.89 76.2,10.16 69.22,10.16 68.58,9.53 | 64.14,9.53 60.96,12.7 60.96,19.68 59.69,20.95 IC5.1 55.88,20.95 | R29.1 35.56,12.06 39.37,15.88 54.61,15.88 55.88,17.14 55.88,20.95 | XBB4.1 57.78,41.91 55.88,40.01 55.88,20.95
  Bottom 0.406: R42.1 81.92,12.06 85.72,12.06 87,10.79 87,5.71 R38.2
  Bottom 0.61: XBB4.1 XBB3.1 57.78,52.7 53.34,57.15 50.16,57.15 | R59.1 24.77,55.24 26.67,53.34 32.38,53.34 36.2,57.15 38.1,57.15 40.01,55.24 40.01,52.7 41.91,50.8 45.72,50.8 47.62,52.7 47.62,54.61 50.16,57.15 | 50.16,57.15 R68.2 R51.1 50.16,71.75 51.44,73.03 51.44,81.28 R77.1 | IC3.1 R29.1 | R38.2 89.53,4.45 93.98,8.89 95.89,8.89 97.54,10.54 97.54,14.22 R30.2
CC
  Top 0.61: R46.1 R45.1 71.75,17.78 70.48,17.78 69.85,18.41 69.85,25.4 64.77,30.48 64.77,38.73 61.59,41.91 XCC1.1
  Bottom 0.61: XCC1.1 XCC2.1 65.41,50.8 67.31,52.7 67.31,59.05 69.22,60.96 IC6.3 | R44.1 R46.1
GND
  Top 0.406: IC4.10 90.81,15.88 90.17,15.24 90.17,3.81 88.27,1.91 80.64,1.91 76.2,6.35 69.22,6.35 68.58,6.99 61.59,6.99 60.33,5.71 IC5.7
  Top 0.61: IC7.4 69.22,76.2 67.94,74.93 59.05,74.93 C15.2 52.07,73.03 49.53,75.56 41.27,75.56 | IC7.6 74.3,71.75 73.03,70.48 C4.2 73.03,58.42 | 73.03,58.42 C5.1 | IC6.5 73.03,58.42 | IC5.10 IC5.11 IC5.12 63.5,15.88 62.23,17.14 62.23,20.32 60.33,22.23 Q1.E | 23.5,37.47 C1.- 17.78,37.47 15.88,35.56 15.88,33.02 10.79,27.94 Z2.A 8.89,29.21 9.53,29.84 IC2.3 | 23.5,37.47 R16.2 25.4,31.75 25.4,31.11 24.13,29.84 22.86,29.84 21.59,28.57 21.59,23.5 22.86,22.23 IC3.5 | 23.5,37.47 Z1.A 24.77,40.01 27.3,42.55 GND26.1 | JP1.4 7.62,66.04 9.53,67.94 9.53,82.55 17.14,90.17 29.84,90.17 31.75,92.08 R74.1 | IC1.12 43.18,22.86 44.45,24.13 44.45,27.94 | 44.45,27.94 44.45,35.56 C11.2 | IC1.5 44.45,27.94 | IC1.10 44.45,27.94 | IC8.12 38.1,73.03 40.64,75.56 41.27,75.56 | 41.27,75.56 R81.1
  Bottom 0.406: IC5.10 61.59,10.79 60.33,9.53 55.24,9.53 54.61,8.89 C2.2 | 52.07,29.21 58.42,29.21 | IC3.5 25.4,22.23 26.67,20.95 36.2,20.95 C9.1
  Bottom 0.61: JP1.5 JP1.6 | JP1.7 JP1.8 | JP1.6 JP1.4 JP1.3 | JP1.6 JP1.8 | JP1.8 6.99,60.33 C12.2 | C12.2 C10.1 | GND26.1 GND.1 24.77,53.34 20.32,53.34 19.05,54.61 19.05,57.15 15.88,60.33 C12.2 | 76.83,82.55 IC7.7 IC7.6 74.3,75.56 73.66,74.93 69.85,74.93 69.22,75.56 IC7.4 | C14.2 IC7.8 76.83,82.55 | 76.83,82.55 72.39,82.55 71.75,83.19 IC7.10 | C16.1 59.69,61.59 | 59.69,61.59 59.69,68.58 57.15,71.12 C15.2 | IC9.5 59.69,61.59 | R81.1 41.27,88.9 38.1,92.08 R74.1 36.83,92.08 35.56,90.81 35.56,88.27 38.73,85.09 38.73,83.19 36.83,81.28 C13.2 | C6.+ 10.16,5.08 5.08,10.16 Z3.C 1.91,10.16 1.02,11.05 1.02,22.61 C3.- 6.99,24.77 8.89,26.67 Z2.A | C2.2 56.52,5.71 IC5.7 | LED1.K 95.89,34.29 C23.2 94.61,31.75 89.53,26.67 89.53,24.77 90.81,23.5 IC4.13 IC4.12 IC4.11 IC4.10 | IC1.5 50.8,27.94 52.07,29.21 | R35.1 58.42,29.21 60.33,27.3 Q1.E | IC1.12 C9.1
  pour Bottom (isolate 0.61, no thermals): 0,48.9 99.06,48.9 99.06,95.25 0,95.25
  pour Bottom (isolate 0.61, no thermals): 99.06,46.35 0,46.35 0,0 99.06,0
N$1
  Bottom 0.61: X1.1 R1.2
N$2
  Bottom 0.61: X2.1 R2.2
N$3
  Top 0.61: R11.1 53.98,35.56 R7.2
  Bottom 0.406: 40.01,21.59 44.45,21.59 46.35,23.5 46.35,28.57 48.26,30.48 IC1.6
  Bottom 0.61: R2.1 R1.1 34.92,12.06 34.92,17.78 38.73,21.59 40.01,21.59 | IC1.6 R11.1 | R12.2 R12.3 48.64,40.01 49.91,38.73 50.8,38.73 R7.2
N$4
  Top 0.406: R3.2 36.2,31.75 36.2,22.86 29.84,16.51 27.3,16.51 26.67,15.88 19.68,15.88 18.41,17.14 IC3.12
  Bottom 0.61: R3.2 38.1,36.2 40.01,38.1 48.9,38.1 R7.1 50.16,34.92 49.53,34.29 IC1.7
N$5
  Top 0.406: R8.1 R9.2
  Bottom 0.61: IC1.9 40.01,30.48 39.37,31.11 R3.1 36.2,31.11 34.29,29.21 R9.2
N$6
  Bottom 0.61: R10.2 53.98,3.17 C2.1 X3.1
N$7
  Bottom 0.61: IC1.3 48.26,22.86 46.99,21.59 46.99,15.88 50.8,12.06 R10.1
N$8
  Bottom 0.61: IC1.1 IC1.2 50.8,20.32 51.44,20.95 51.44,25.4 R11.2
N$9
  Bottom 0.61: C3.+ X4.1 R6.1 7.62,19.05 Z2.C
N$10
  Bottom 0.61: X5.1 7.62,15.24 8.26,14.61 R18.1 Z3.A 10.16,7.62 12.7,5.08 C6.-
N$11
  Bottom 0.61: X6.1 40.51,2.54 C8.+
N$12
  Bottom 0.406: IC1.8 40.01,33.02 39.37,32.38 35.56,32.38 33.02,29.84 33.02,27.94 R9.1 31.11,26.04 22.23,26.04 18.41,22.23 IC3.10
N$13
  Top 0.406: R13.3 31.11,29.21 29.84,27.94 29.84,25.4 R8.2
  Bottom 0.61: R13.2 R13.3
N$14
  Bottom 0.61: R36.2 C8.-
N$15
  Top 0.406: IC3.3 25.4,17.14 26.67,18.41 26.67,30.48 R16.1
  Top 0.61: R17.2 29.21,35.56 29.21,33.02 R16.1
N$16
  Bottom 0.61: C7.- 38.73,17.14 39.37,17.78 IC1.14 43.18,17.78 44.45,16.51 44.45,13.34 R40.1
N$17
  Top 0.406: R22.2 R19.1
  Bottom 0.406: IC3.6 R22.2
N$18
  Bottom 0.61: IC3.2 27.3,14.61 R26.1 29.84,15.24 R29.2
N$19
  Bottom 0.61: R19.2 R26.2 29.84,17.78 30.48,17.14 C7.+
N$20
  Top 0.61: C1.+ 20.95,34.92 Z1.C
  Bottom 0.61: IC2.5 15.88,39.37 | 15.88,39.37 R4.1 | C1.+ 17.14,34.92 15.88,36.2 15.88,39.37
N$21
  Bottom 0.61: R36.1 43.81,10.16 R40.2 46.99,12.06 46.99,13.34 45.72,14.61 45.72,17.78 43.18,20.32 IC1.13
N$22
  Top 0.406: R42.2 80.01,12.7 81.28,12.7 81.92,13.34 81.92,15.88 | 81.92,15.88 81.92,24.77 R39.1 | IC4.5 81.92,15.88
N$23
  Top 0.406: IC2.2 6.99,35.56 5.71,36.83 5.71,41.27 R5.1
  Bottom 0.61: IC2.2 6.99,29.84 6.35,29.21 R14.2
N$24
  Bottom 0.61: R43.2 IC4.4
N$25
  Bottom 0.61: IC4.9 93.98,13.34 | 93.98,13.34 R30.1 | R27.2 94.23,16.76 94.23,13.59 93.98,13.34
N$26
  Bottom 0.406: R37.1 87,14.61 90.81,10.79 IC4.8
N$27
  Top 0.61: R23.1 23.5,8.89 24.77,10.16 35.56,10.16 40.01,14.61 55.88,14.61 57.15,15.88 IC5.3
  Bottom 0.406: IC5.3 60.33,15.88 61.59,14.61 67.94,14.61 68.58,13.97 77.47,13.97 R37.2
  Bottom 0.61: IC3.14 17.14,12.06 19.05,10.16 R23.1 | R37.2 R43.1
N$28
  Bottom 0.61: IC3.13 15.24,14.61 13.97,13.34 13.97,10.16 R20.1 17.78,6.35 R23.2
N$29
  Top 0.406: R20.2 12.7,16.51 14.61,18.41 18.41,18.41 19.68,19.68 19.68,29.21 R21.2
  Bottom 0.406: IC3.7 R22.1
  Bottom 0.61: R21.2 24.13,28.57 IC3.7
N$30
  Bottom 0.61: IC3.9 R24.2 11.18,26.29 11.18,27.69 14.61,31.11 R21.1
N$31
  Bottom 0.61: D2.C D1.C 59.69,33.02 | 59.69,33.02 R33.1 | R35.2 59.69,33.02
N$32
  Top 0.406: IC5.8 61.59,5.71 59.69,3.81 55.88,3.81 51.44,8.26 34.29,8.26 33.02,6.99 26.04,6.99 22.86,3.81 16.51,3.81 13.34,6.99 10.16,6.99 7.62,9.53 7.62,16.51 10.79,19.68 10.79,25.4 R24.1
  Bottom 0.61: IC3.8 R24.1 | IC5.8 78.11,5.71 79.38,4.45 R32.2
N$33
  Top 0.61: IC4.14 88.9,26.04 87,27.94 83.19,27.94 81.28,29.84 81.28,33.02 83.82,35.56 83.82,43.18 81.92,45.09 74.3,45.09 69.22,40.01 D2.A
  Bottom 0.406: 64.14,27.94 64.14,24.13
  Bottom 0.61: IC5.5 55.24,10.79 53.98,12.06 R31.1 52.7,20.32 52.7,22.86 53.98,24.13 59.05,24.13 59.69,23.5 63.5,23.5 64.14,24.13 | IC4.14 93.98,26.04 95.89,24.13 R27.1 | D2.A 66.04,40.01 62.87,36.83 62.87,35.56 64.77,33.66 64.77,29.21 64.14,28.57 64.14,27.94
N$34
  Bottom 0.61: Q1.B R33.2
N$35
  Bottom 0.61: IC4.6 86.36,13.34 88.27,11.43 R38.1
N$36
  Bottom 0.61: R32.1 R28.2 IC4.7
N$37
  Top 0.61: IC5.13 67.31,18.41 68.58,19.68 68.58,24.77 67.31,26.04 Q1.C
  Bottom 0.61: IC5.13 69.85,18.41 70.48,17.78 74.93,17.78 78.11,20.95 R25.1
N$38
  Top 0.61: IC4.1 85.72,26.04 87,24.77 87,9.53 86.36,8.89 86.36,6.35 R28.1
  Bottom 0.61: IC5.6 60.33,8.26 X21.1 67.94,4.45 77.47,4.45 79.38,2.54 82.55,2.54 R28.1 | IC4.1 85.09,26.04 88.27,29.21 88.27,30.48 87,31.75 81.92,31.75 78.11,27.94 70.48,27.94 69.22,29.21 69.22,31.75 R34.1 69.22,32.26 69.22,34.92 67.94,36.2 D1.A
N$39
  Bottom 0.61: X10.1 C18.1
N$40
  Bottom 0.61: IC5.9 R44.2
N$41
  Bottom 0.406: IC5.4 60.33,13.34 61.59,12.06 R46.2
N$42
  Bottom 0.406: IC5.2 60.33,18.41 61.59,17.14 69.85,17.14 R45.2
N$43
  Bottom 0.61: C17.2 R53.1
N$44
  Bottom 0.61: C18.2 R57.1
N$45
  Bottom 0.61: R65.1 C19.2
N$46
  Bottom 0.61: C20.2 R72.1
N$47
  Bottom 0.61: R80.1 C21.2
N$48
  Bottom 0.61: C22.+ 86.49,52.83 85.09,51.44 81.92,51.44 R83.1 74.93,58.42 74.93,62.23 76.2,63.5 IC6.7
N$49
  Bottom 0.61: R88.2 LED1.A 95.89,39.37 X20.1
N$50
  Bottom 0.61: Q3.3 74.93,43.81 76.2,45.09 85.09,45.09 R88.1
N$51
  Bottom 0.61: R53.2 R57.2 R65.2 R72.2 R80.2 | R80.2 IC6.6 | R80.2 81.28,54.61 R83.2
N$52
  Bottom 0.61: X11.1 C19.1
N$53
  Bottom 0.61: X13.1 C20.1
N$54
  Bottom 0.61: X15.1 C21.1
N$55
  Bottom 0.61: IC9.2 IC9.1 54.61,78.11 59.05,82.55 X16.1
N$56
  Bottom 0.61: R63.2 R66.2 81.28,80.01 78.74,77.47 78.74,74.93 76.2,72.39 70.48,72.39 67.94,69.85 67.94,66.04 R58.1 IC9.6
N$57
  Bottom 0.61: X12.1 R63.1
N$58
  Bottom 0.61: X14.1 R66.1
N$59
  Bottom 0.61: IC9.7 R58.2 R54.1
N$60
  Top 0.406: IC8.4 33.02,70.48 34.29,71.75 38.1,71.75
  Top 0.61: 38.1,71.75 55.88,71.75 56.52,71.12 60.33,71.12 61.59,72.39 R54.2
  Bottom 0.61: IC8.4 26.67,70.48 25.4,71.75 R55.2 18.41,71.75 15.24,68.58 15.24,67.31 R50.2
N$61
  Top 0.61: R55.1 24.77,59.05 26.67,57.15 43.18,57.15 45.72,59.69 R67.2
  Bottom 0.61: R55.1 24.77,64.14 26.04,65.41 IC8.6
N$62
  Bottom 0.61: IC8.8 38.1,62.87 41.91,59.05 R76.1 R67.1
N$63
  Bottom 0.61: R76.2 41.91,67.94 | 41.91,67.94 41.91,73.03 R81.2 | IC8.10 41.91,67.94
N$64
  Bottom 0.61: R77.2 R78.1 43.18,75.56 40.64,75.56 39.37,74.3 39.37,71.75 38.1,70.48 IC8.11
N$65
  Bottom 0.61: R68.1 38.73,66.04 38.1,65.41 IC8.9 34.29,65.41 33.02,64.14 33.02,61.59 35.56,59.05 R69.2
N$66
  Bottom 0.61: R60.1 R59.2 20.95,62.23 23.5,59.69 25.4,59.69 IC8.7
N$67
  Top 0.406: IC8.5 31.75,67.94 33.02,69.22 39.37,69.22 R51.2
  Bottom 0.61: IC8.5 25.4,67.94 22.86,70.48 19.68,70.48 R47.2
N$68
  Bottom 0.61: R48.2 R47.1 | IC8.2 18.41,75.56 17.14,76.83 R47.1 | R47.1 17.14,79.38 R52.1
N$69
  Bottom 0.61: R60.2 24.77,78.11 | 24.77,78.11 IC8.1 | 24.77,78.11 R61.1 24.77,81.92 R64.1
N$70
  Top 0.61: IC7.3 66.67,79.38 65.41,80.64 62.87,80.64 55.24,88.27 R73.2
  Bottom 0.61: R70.2 R69.1 29.21,59.05 31.75,61.59 31.75,73.03 32.38,73.66 32.38,76.2 34.29,78.11 IC8.14 38.73,78.11 40.01,79.38 40.01,85.72 R73.2
N$71
  Top 0.61: IC8.13 34.29,75.56 27.3,82.55 24.13,82.55 22.86,81.28 19.05,81.28 R82.2
  Bottom 0.61: R79.1 R82.2 | IC8.13 38.73,75.56 40.01,76.83 43.18,76.83 45.09,78.74 R78.2
N$72
  Bottom 0.61: R82.1 R52.2 21.59,93.98 27.3,93.98 | 27.3,93.98 41.91,93.98 53.34,82.55 53.34,71.75 52.07,70.48 52.07,65.41 53.34,64.14 IC9.3 | R64.2 34.29,84.45 30.48,88.27 R73.1 R74.2 27.3,93.98
N$73
  Bottom 0.61: X9.1 C17.1
N$74
  Bottom 0.61: Q3.1 80.01,40.64 81.28,39.37 R87.1 R85.1
N$75
  Bottom 0.61: Q2.3 86.36,34.92 | 86.36,34.92 87.63,34.92 C23.1 | R85.2 86.36,34.92
N$76
  Bottom 0.61: IC7.5 71.75,79.38 71.12,80.01 64.77,80.01 64.14,79.38 IC7.2
N$77
  Bottom 0.61: X18.1 69.22,90.17 IC7.11 69.22,83.19 68.58,82.55 64.14,82.55 61.59,80.01 IC7.1
N$78
  Top 0.61: IC7.12 66.67,86.36 67.94,87.63 73.03,87.63 74.3,86.36 IC7.9
N$79
  Bottom 0.61: IC7.13 64.14,91.44 X19.1
N$80
  Bottom 0.61: X17.1 89.03,57.15 C22.-
N$81
  Bottom 0.61: Q2.1 R86.1 71.12,30.48 R84.1
N$82
  Bottom 0.61: D3.C R84.2
N$83
  Bottom 0.61: IC6.1 IC6.2 72.39,63.5 73.66,62.23 73.66,56.52 80.01,50.16 92.08,50.16 X8.1

### Text on the board
tPlace: WaveFreak B1 | Wave / Freak B2